# EasyEDA Pro project ProProject_FPGA_oscilloscope Analog pre circuit PCB_2024-04-16.epro, board PCB1
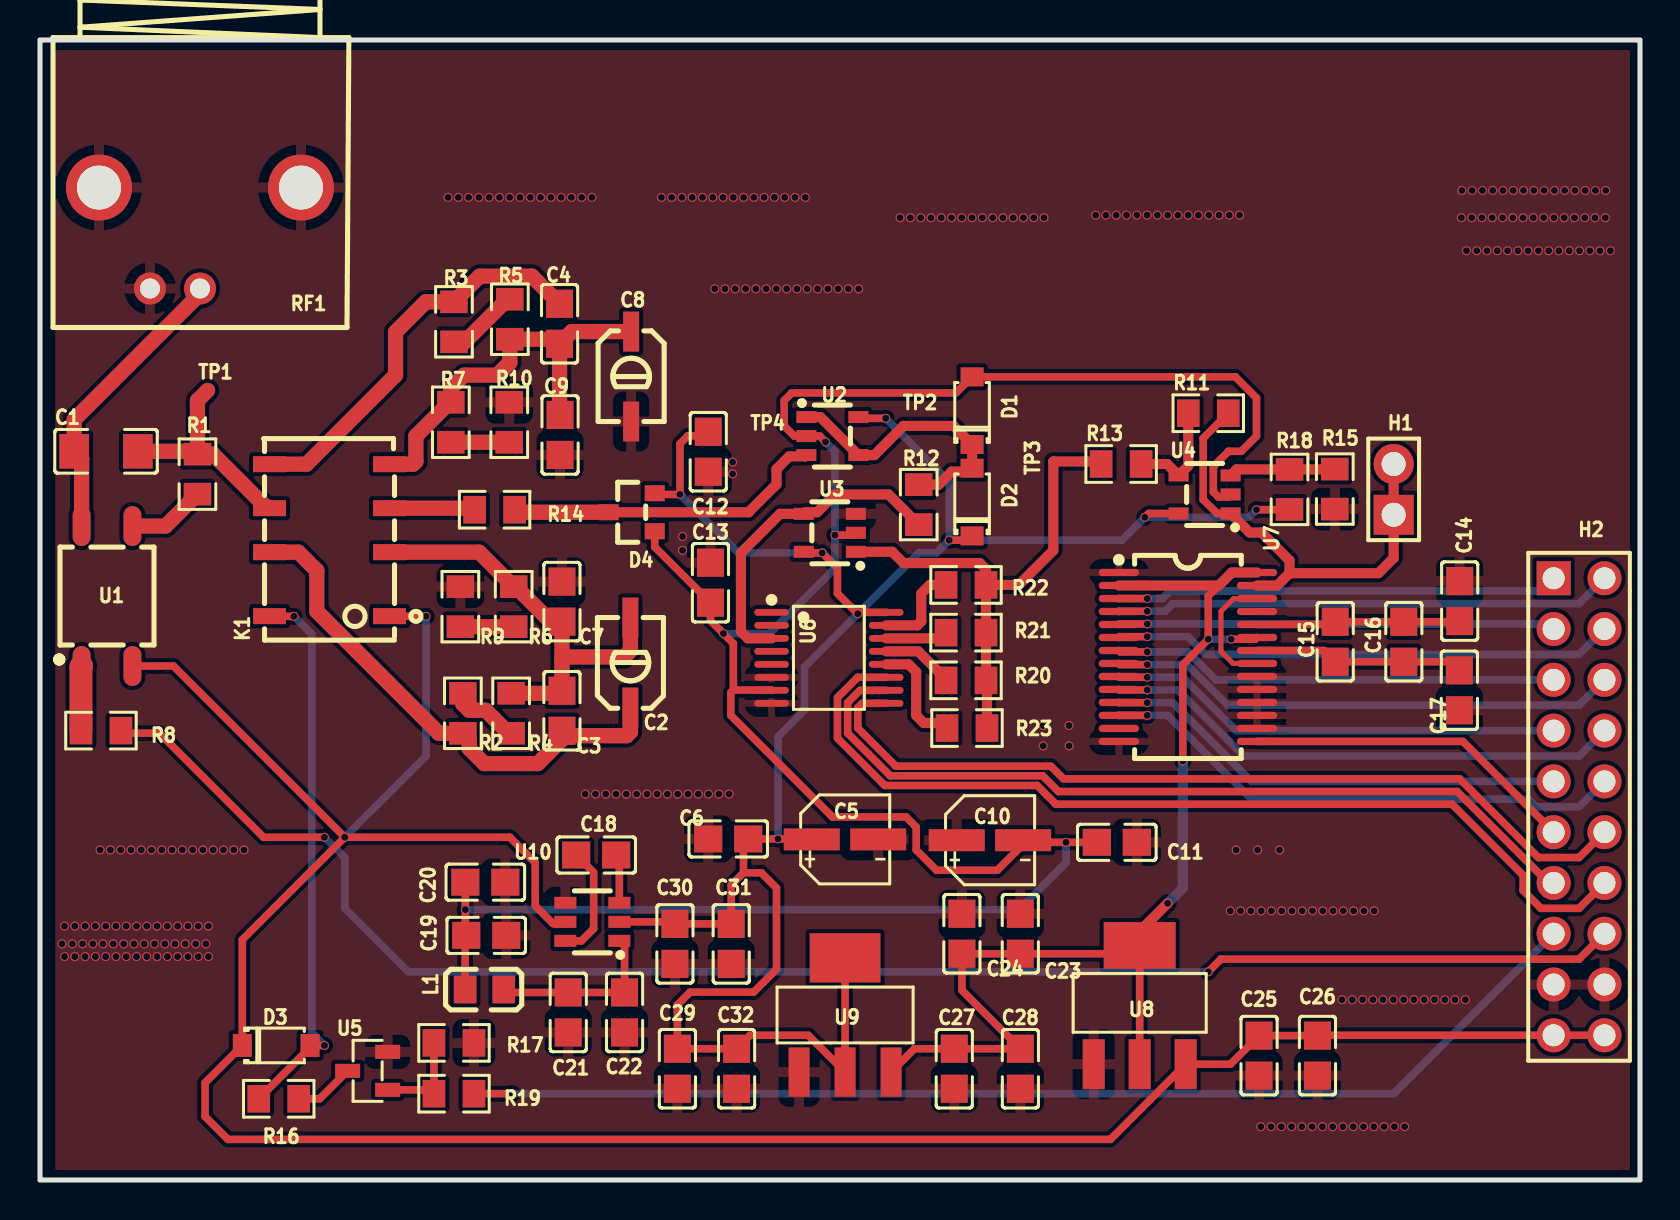
[diagram p2: board, top side]
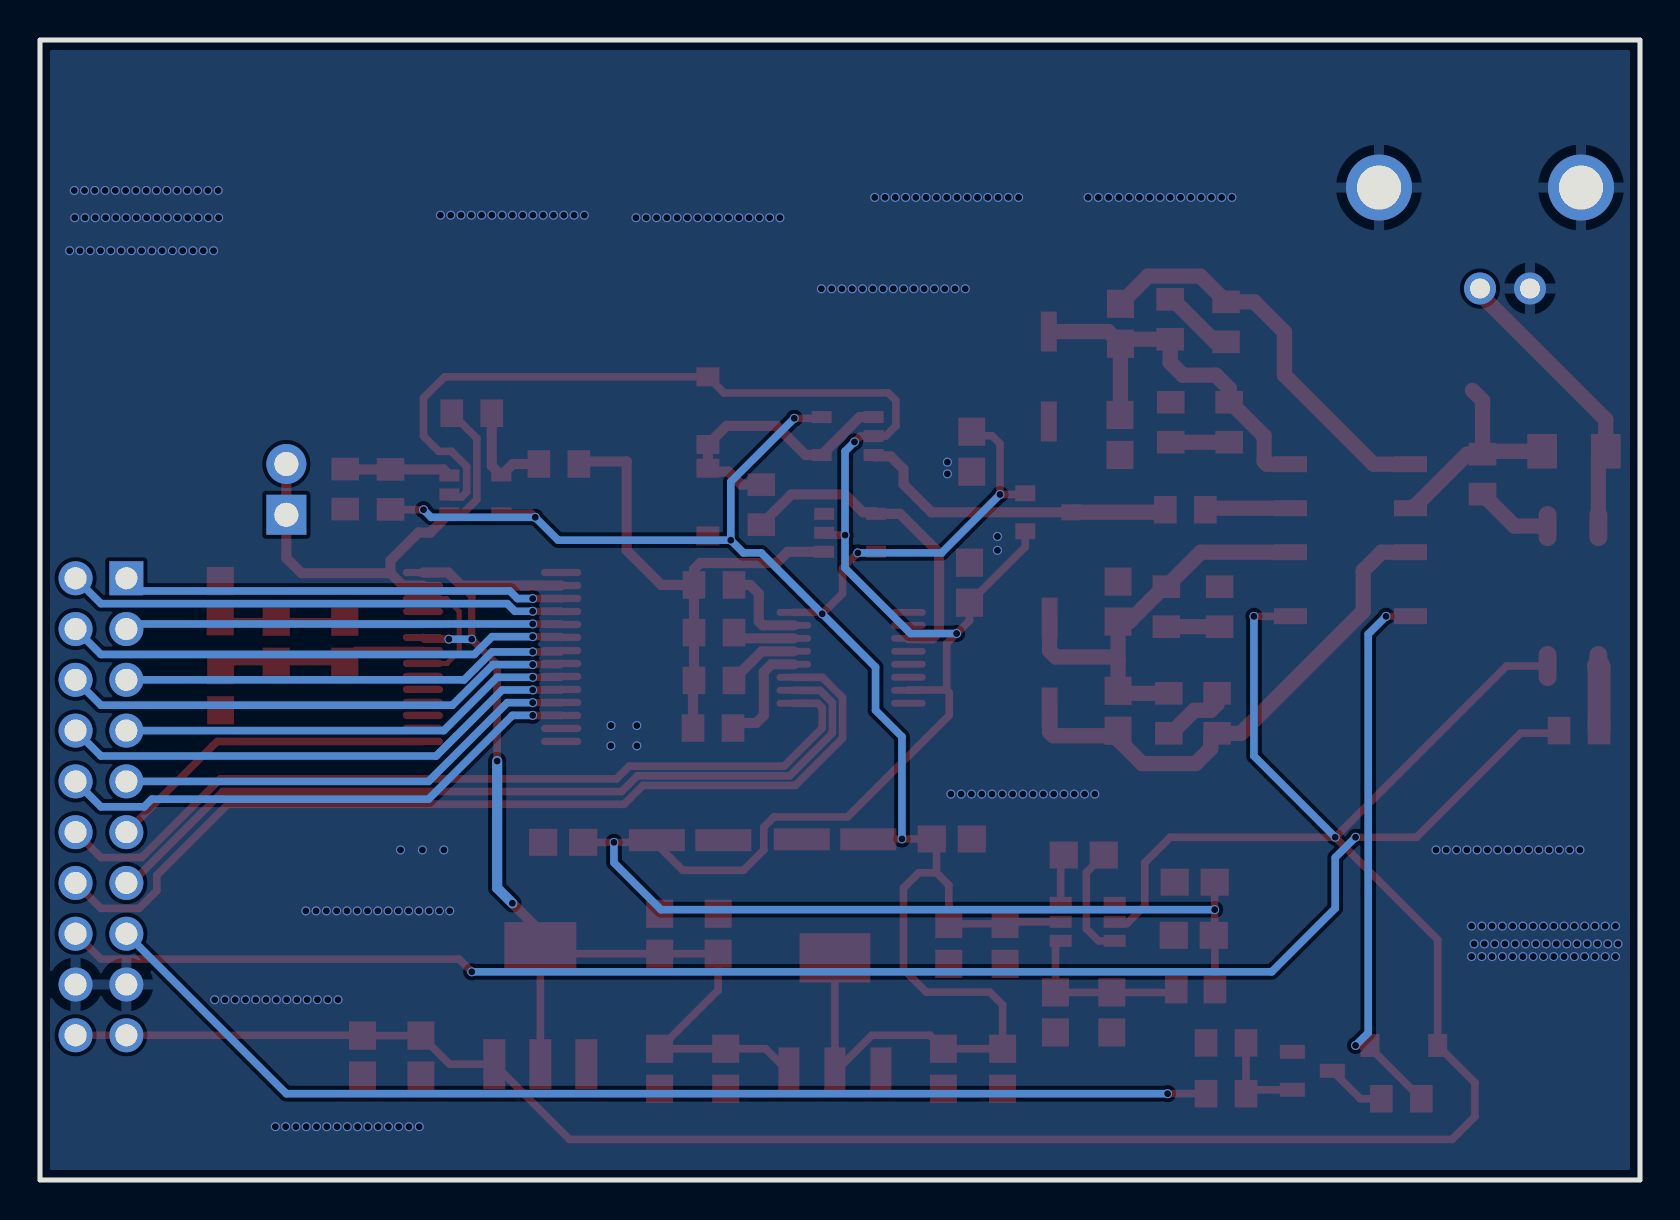
[diagram p3: board, bottom side, seen from below]

Outline 80.01 x 57.02 mm; copper layers: Top Layer, Bottom Layer. Coordinates in mm from the lower left corner of the outline.
Outline path: rectangle 0,57.02 80.01,0
Stack: Top Layer 0.035mm / Dielectric1 1.51mm FR4 er 4.5 / Bottom Layer 0.035mm

## Design rules (mm)
template: 自定义配置
spacing copperThickness1oz (default): track to track 0.102, other pairs 0.152 to 0.3
spacing copperThickness2oz: track to track 0.203, other pairs 0.152 to 0.3
track width copperThickness1oz (default): min 0.127, default 0.254, max 2.54
track width copperThickness2oz: min 0.203, default 0.254, max 2.54
differential pair differentialPair (default): width min 0.127, default 0.254, max 2.54; gap min 0.152, default 0.152
via viaSize (default): diameter min 0.356, default 0.61, max 10; hole min 0.229, default 0.305, max 6.299

## Placement (name value [footprint] x y rotation side)
C1  22nF  [C1206]  3.3 36.45 0 top
C2  360pf  [CAP-SMD_L4.50-W3.20]  29.52 25.88 90 top
C3  TZC3Z060A110R00  [C0805]  26.1 23.47 270 top
C4  15Pf  [C0805]  25.98 42.83 90 top
C5  104pf  [CAP-SMD_BD4.0-L4.3-W4.3-FD-A]  40.25 17.04 0 top
C6  104pf  [C0805]  34.41 17.06 0 top
C7  TZC3Z060A110R00  [C0805]  26.1 28.93 270 top
C8  15Pf  [CAP-SMD_L4.50-W3.20]  29.56 40.19 270 top
C9  360pf  [C0805]  26.01 37.27 90 top
C10  22uF  [CAP-SMD_BD4.0-L4.3-W4.3-FD-A]  47.5 17 0 top
C11  22uF  [C0805]  53.85 16.89 180 top
C12  360pf  [C0805]  33.42 36.43 90 top
C13  360pf  [C0805]  33.53 29.88 270 top
C14  100nf  [C0805]  70.99 28.96 270 top
C15  100nf  [C0805]  64.77 26.92 90 top
C16  10uf  [C0805]  68.2 26.92 90 top
C17  100nf  [C0805]  70.98 24.49 90 top
C18  47uf  [C0805]  27.81 16.26 0 top
C19  10uf  [C0805]  22.31 12.24 180 top
C20  47uf  [C0805]  22.27 14.9 180 top
C21  10uf  [C0805]  26.42 8.38 90 top
C22  4.7uf  [C0805]  29.23 8.38 90 top
C23  100nf  [C0805]  49.02 12.32 270 top
C24  22uf  [C0805]  46.1 12.32 270 top
C25  10uf  [C0805]  60.96 6.22 90 top
C26  100nf  [C0805]  63.88 6.22 90 top
C27  100nf  [C0805]  45.72 5.57 90 top
C28  10uf  [C0805]  49.03 5.57 90 top
C29  22uf  [C0805]  31.87 5.57 90 top
C30  10uf  [C0805]  31.75 11.81 90 top
C31  47uf  [C0805]  34.57 11.81 90 top
C32  100nf  [C0805]  34.83 5.57 90 top
D1  1N4148W  [SOD-123_L2.8-W1.8-LS3.7-RD]  46.61 38.48 90 top
D2  BAV199LT1G  [SOD-123_L2.8-W1.8-LS3.7-RD]  46.61 33.91 90 top
D3  1N4148W  [SOD-123_L2.8-W1.8-LS3.7-RD]  11.81 6.73 0 top
D4  BAV199LT1G  [SOT-23_L2.9-W1.3-P1.90-LS2.4-BR]  29.59 33.4 0 top
H1  PZ254V-11-02P  [HDR-TH_2P-P2.54-V-M]  67.69 34.54 90 top
H2  PZ254V-12-20P  [HDR-TH_20P-P2.54-V-M-R2-C10-S2.54]  76.96 18.67 270 top
K1  HFD4/3-S1R  [RELAY-SMD_HFD4-3-S1R]  14.48 32 90 top
L1  YI201209U121-5R0T  [L0805]  22.22 9.52 0 top
R1  56Ω  [R0805]  7.87 35.31 270 top
R2  680kΩ  [R0805]  21.15 23.34 90 top
R3  300kΩ  [R0805]  20.7 42.93 270 top
R4  300kΩ  [R0805]  23.56 23.34 90 top
R5  300kΩ  [R0805]  23.5 43.05 270 top
R6  1.5kΩ  [R0805]  23.69 28.68 270 top
R7  4kΩ  [R0805]  20.54 37.9 270 top
R8  200kΩ  [R0805]  3.05 22.48 180 top
R9  1.5kΩ  [R0805]  21.02 28.68 90 top
R10  1.5kΩ  [R0805]  23.47 37.9 90 top
R11  1kΩ  [R0805]  58.42 38.35 0 top
R12  16kΩ  [R0805]  43.94 33.78 270 top
R13  200kΩ  [R0805]  54.06 35.81 0 top
R14  200kΩ  [R0805]  22.73 33.53 0 top
R15  100R  [R0805]  64.75 34.56 270 top
R16  3kΩ  [R0805]  11.94 4.06 180 top
R17  200kΩ  [R0805]  20.7 6.86 180 top
R18  200kΩ  [R0805]  62.48 34.54 90 top
R19  200kΩ  [R0805]  20.7 4.32 180 top
R20  3kΩ  [R0805]  46.31 24.99 0 top
R21  100R  [R0805]  46.31 27.38 0 top
R22  10K  [R0805]  46.31 29.77 0 top
R23  100R  [R0805]  46.35 22.61 0 top
RF1  KH-BNC75-3511  [ANT-TH_KH-BNC75-3511]  8 47.12 180 top
TP1  -  [Test-Point-0.5mm]  8.38 39.5 0 top
TP2  -  [Test-Point-0.5mm]  44.2 37.72 0 top
TP3  -  [Test-Point-0.5mm]  50.67 35.94 0 top
TP4  -  [Test-Point-0.5mm]  35.43 33.4 0 top
U1  AQY282SX  [SOP-4_L4.3-W4.4-P2.54-LS7.0-BL]  3.35 29.21 0 top
U2  GS8094-SR  [SOT-23-5_L3.0-W1.7-P0.95-LS2.8-BR]  39.62 37.21 180 top
U3  SI2302ADS-T1-JSM  [SOT-23-5_L3.0-W1.7-P0.95-LS2.8-BR]  39.5 32.37 0 top
U4  MS9280  [SOT-23-5_L3.0-W1.7-P0.95-LS2.8-BR]  58.24 34.29 0 top
U5  74HC4052PW,118  [SOT-23-3_L2.9-W1.3-P1.90-LS2.4-BR]  16.38 5.46 0 top
U6  AMS1117-3.3  [TSSOP-16_L5.0-W4.4-P0.65-LS6.4-BL]  39.45 26.12 270 top
U7  AMS1117-2.5V  [SSOP-28_L10.2-W5.3-P0.65-LS7.8-BL]  57.4 26.16 270 top
U8  SGM3204YN6G/TR  [SOT-223-3_L6.5-W3.5-P3.05-LS7.0]  54.99 8.76 270 top
U9  AMS1117-2.5V  [SOT-223_L6.5-W3.5-P2.30-LS7.0-BR]  40.26 8.25 270 top
U10  SGM3204YN6G/TR  [SOT-23-6_L2.9-W1.6-P0.95-LS2.8-BR]  27.62 12.91 0 top

## Footprints (pads in the part's own frame, mm; a bottom-side part is the same pattern mirrored in y, then rotated)
ANT-TH_KH-BNC75-3511
  round 1.6 hole 1: 1(0,2.525) 2(2.5,2.525)
  round 3.3 hole 2.2: 3(5.05,-2.525) 4(-5.05,-2.525)
C0805
  rect 1.41x1.35 smd: 1(-1,0) 2(1,0)
C1206
  rect 1.485x1.728 smd: 1(-1.593,0) 2(1.593,0)
CAP-SMD_BD4.0-L4.3-W4.3-FD-A
  rect 2.8x1.1 smd: 1(-1.661,0) 2(1.661,0)
CAP-SMD_L4.50-W3.20
  rect 2x0.8 smd: 1(-2.25,0) 2(2.25,0)
HDR-TH_2P-P2.54-V-M
  rect 2x2 hole 1.2: 1(-1.27,0)
  round 2 hole 1.2: 2(1.27,0)
HDR-TH_20P-P2.54-V-M-R2-C10-S2.54
  rect 1.7x1.7 hole 1.1: 1(-11.43,-1.27)
  round 1.7 hole 1.1: 2(-11.43,1.27) 3(-8.89,-1.27) 4(-8.89,1.27) 5(-6.35,-1.27) 6(-6.35,1.27) 7(-3.81,-1.27) 8(-3.81,1.27) 9(-1.27,-1.27) 10(-1.27,1.27) 11(1.27,-1.27) 12(1.27,1.27) 13(3.81,-1.27) 14(3.81,1.27) 15(6.35,-1.27) 16(6.35,1.27) 17(8.89,-1.27) 18(8.89,1.27) 19(11.43,-1.27) 20(11.43,1.27)
L0805
  rect 1.133x1.377 smd: 1(-0.966,0) 2(0.966,0)
R0805
  rect 1.133x1.377 smd: 1(-1,0) 2(1,0)
RELAY-SMD_HFD4-3-S1R
  rect 0.8x1.65 smd: 1(-3.8,-3) 2(-0.6,-3) 3(1.6,-3) 4(3.8,-3) 5(3.8,3) 6(1.6,3) 7(-0.6,3) 8(-3.8,3)
SOD-123_L2.8-W1.8-LS3.7-RD
  rect 0.95x1.15 smd: 1(-1.692,0) 2(1.692,0)
SOP-4_L4.3-W4.4-P2.54-LS7.0-BL
  oval 0.9x2 smd: 1(-1.27,-3.5) 2(1.27,-3.5) 3(1.27,3.5) 4(-1.27,3.5)
SOT-23-3_L2.9-W1.3-P1.90-LS2.4-BR
  rect 1.25x0.7 smd: 1(1,-0.95) 2(1,0.95) 3(-1,0)
SOT-23-5_L3.0-W1.7-P0.95-LS2.8-BR
  rect 1x0.6 smd: 1(1.3,-0.95) 2(1.3,0) 3(1.3,0.95) 4(-1.3,0.95) 5(-1.3,-0.95)
SOT-23-6_L2.9-W1.6-P0.95-LS2.8-BR
  rect 1.1x0.6 smd: 1(1.35,-0.95) 2(1.35,0) 3(1.35,0.95) 4(-1.35,0.95) 5(-1.35,0) 6(-1.35,-0.95)
SOT-23_L2.9-W1.3-P1.90-LS2.4-BR
  rect 1x0.8 smd: 1(1.15,-0.95) 2(1.15,0.95) 3(-1.15,0)
SOT-223-3_L6.5-W3.5-P3.05-LS7.0
  rect 2.5x1.1 smd: 1(2.97,-2.3) 2(2.97,0) 3(2.97,2.3)
  rect 2.34x3.6 smd: 4(-2.97,0)
SOT-223_L6.5-W3.5-P2.30-LS7.0-BR
  rect 2.465x1.05 smd: 1(2.857,-2.3) 2(2.857,0) 3(2.857,2.3)
  rect 2.465x3.54 smd: 4(-2.857,0)
SSOP-28_L10.2-W5.3-P0.65-LS7.8-BL
  oval 0.364x2.015 smd: 1(-4.225,-3.455) 2(-3.575,-3.455) 3(-2.925,-3.455) 4(-2.275,-3.455) 5(-1.625,-3.455) 6(-0.975,-3.455) 7(-0.325,-3.455) 8(0.325,-3.455) 9(0.975,-3.455) 10(1.625,-3.455) 11(2.275,-3.455) 12(2.925,-3.455) 13(3.575,-3.455) 14(4.225,-3.455) 15(4.225,3.455) 16(3.575,3.455) 17(2.925,3.455) 18(2.275,3.455) 19(1.625,3.455) 20(0.975,3.455) 21(0.325,3.455) 22(-0.325,3.455) 23(-0.975,3.455) 24(-1.625,3.455) 25(-2.275,3.455) 26(-2.925,3.455) 27(-3.575,3.455) 28(-4.225,3.455)
Test-Point-0.5mm
  round 0.5 smd: 1(0,0)
TSSOP-16_L5.0-W4.4-P0.65-LS6.4-BL
  oval 0.343x1.732 smd: 1(-2.275,-2.866) 2(-1.625,-2.866) 3(-0.975,-2.866) 4(-0.325,-2.866) 5(0.325,-2.866) 6(0.975,-2.866) 7(1.625,-2.866) 8(2.275,-2.866) 9(2.275,2.866) 10(1.625,2.866) 11(0.975,2.866) 12(0.325,2.866) 13(-0.325,2.866) 14(-0.975,2.866) 15(-1.625,2.866) 16(-2.275,2.866)

## Nets
2.5V: C5.1 C6.2 C12.2 C29.2 C30.2 C31.2 C32.2 D2.1 D4.2 R18.1 U2.5 U3.5 U4.5 U6.16 U9.2 U9.4 U10.2
+5V: C25.2 C26.2 D3.1 H2.19 H2.20 K1.1 U1.2 U8.3 U10.5
-2.5V: C10.2 C11.2 C13.2 C19.2 C20.2 D1.2 D4.1 L1.1 U2.2 U3.2 U4.2 U6.7
GND: C5.2 C6.1 C7.1 C8.2 C9.1 C10.1 C11.1 C12.1 C13.1 C14.1 C17.1 C19.1 C20.1 C21.1 C22.1 C23.1 C24.1 C25.1 C26.1 C27.1 C28.1 C29.1 C30.1 C31.1 C32.1 H2.17 H2.18 R9.2 R10.2 R15.2 R17.1 RF1.2 RF1.3 RF1.4 U3.3 U5.2 U6.6 U6.8 U7.1 U7.14 U7.16 U7.17 U7.18 U7.19 U7.20 U7.25 U8.1 U9.1 U10.4
3.3: C23.2 C24.2 C27.2 C28.2 U7.2 U7.23 U7.28 U8.2 U8.4 U9.3
ADC0_CLK: H2.11 U7.15
AIN1: H1.1 H1.2 R11.2 U4.1 U7.27
ANGOUT: R13.1 R20.2 R21.2 R22.2 R23.2 TP3.1 U3.1
D0: H2.1 U7.3
D1: H2.2 U7.4
D2: H2.3 U7.5
D3: H2.4 U7.6
D4: H2.5 U7.7
D5: H2.6 U7.8
D6: H2.7 U7.9
D7: H2.8 U7.10
D8: H2.9 U7.11
D9: H2.10 U7.12
DIORA0: H2.16 R8.1
DIORA1: H2.15 R19.1
RE0: D3.2 K1.8 R16.2
S0: H2.14 U6.11
S1: H2.13 U6.10
S2: H2.12 U6.9
Y0: R20.1 U6.13
Y1: R21.1 U6.14
Y2: R22.1 U6.15
Y3: R23.1 U6.12
Z: R12.2 U3.4 U6.3
$1N691: C1.1 RF1.1 U1.4
$1N811: R8.2 U1.1
$1N857: R1.2 U1.3
$1N871: C1.2 K1.6 R1.1 TP1.1
$1N1249: C2.1 C3.2 K1.7 R2.1
$1N1320: K1.3 R14.1
$1N1547: C2.2 C3.1 C7.2 K1.2 R4.2 R6.1
$1N1899: R17.2 R19.2 U5.1
$1N2058: R16.1 U5.3
$1N2253: D4.3 R14.2 TP4.1 U2.3
$1N6224: R6.2 R9.1
$1N6262: R2.2 R4.1
$1N6325: C4.2 K1.5 R3.1
$1N6377: R3.2 R5.1
$1N6535: R7.2 R10.1
$1N6629: D1.1 D2.2 R12.1 TP2.1 U2.1 U2.4
$1N7875: R11.1 R13.2 U4.4
$1N8016: R15.1 R18.2 U4.3
$1N8606: U7.21 U7.26
$1N17008: C21.2 C22.2 L1.2 U10.1
$1N17602: C14.2 C15.2 C16.2 U7.24
$1N17632: C15.1 C16.1 C17.2 U7.22
$1N20744: C18.1 U10.6
$1N20751: C18.2 U10.3
$1N20802: C4.1 C8.1 C9.2 K1.4 R5.2 R7.1

Pads without a net: U6 1 2 4 5; U7 13

## Via types
v1: diameter 0.45, hole 0.35, Top Layer to Bottom Layer, 283 vias

## Routing (per net, layer and track width the routed paths; a pad name or vN(x,y) marks a point on that pad's centre or on a via; arc(x,y) is an arc through that point)
2.5V: length 111.1
  Top Layer w0.381: C12.2 33.21,37.22 32.4,37.22 32,36.83 v1(32,34.29) 30.8,34.29 D4.2 ; 35.18,15.37 35.18,16.82 C6.2 v1(36.91,17.06) 38.57,17.06 C5.1 ; 35.18,15.37 36.07,15.37 36.83,14.6 36.83,10.54 35.69,9.4 32.51,9.4 31.87,8.76 C29.2 C32.2 35.51,7.24 38.42,7.24 U9.2 U9.4 ; 35.18,15.37 34.57,14.75 34.57,13.08 ; 34.57,13.08 C31.2 ; 34.57,13.08 34.29,12.81 C30.2 31.65,12.91 U10.2 ; U4.5 55.44,33.34 v1(55.25,33.15) ; v1(45.47,32) 46.4,32 D2.1 ; U3.5 38.25,31.37 v1(39.12,31.37) 39.88,30.61 39.88,29.34 v1(40.89,28.32) 40.97,28.39 U6.16 ; 40.92,38.16 40.99,38.1 v1(42.29,38.1) ; R18.1 62.47,33.53 v1(60.83,33.53)
  Bottom Layer w0.381: v1(36.91,17.06) 36.91,22.17 38.23,23.49 38.23,25.65 v1(40.89,28.32) 43.94,31.37 44.83,31.37 v1(45.47,32) ; v1(60.83,33.53) 60.45,33.15 v1(55.25,33.15) 54.1,32 v1(45.47,32) ; v1(45.47,32) 45.47,34.92 v1(42.29,38.1) ; v1(32,34.29) 34.93,31.37 v1(39.12,31.37)
+5V: length 132.3
  Top Layer w0.381: U10.5 26.18,12.83 25.65,12.83 24.76,13.72 24.76,15.87 23.5,17.14 v1(15.24,17.14) ; v1(19.3,28.19) 17.49,28.19 K1.1 ; U1.2 6.67,25.71 v1(15.24,17.14) ; v1(15.24,17.14) 10.12,12.02 D3.1 8.25,4.87 8.25,3.17 9.4,2.03 53.53,2.03 U8.3 59.53,5.79 C25.2 C26.2 63.9,7.24 H2.19 H2.20
  Bottom Layer w0.381: v1(15.24,17.14) 19.3,21.21 v1(19.3,28.19)
-2.5V: length 122.9
  Top Layer w0.381: U3.2 40.68,32.26 v1(39.75,32.26) ; C20.2 v1(21.27,13.52) 21.27,12.19 ; 34.67,24.51 36.57,24.51 U6.7 ; 34.67,24.51 34.54,24.38 34.54,23.24 39.62,18.16 43.31,18.16 43.81,17.65 43.81,16.51 44.83,15.49 47.87,15.49 49.27,16.89 ; 34.67,24.51 34.67,26.84 v1(34.17,27.34) 33.53,27.98 C13.2 30.74,31.66 D4.1 ; 21.27,12.19 21.26,12.18 L1.1 ; 21.27,12.19 C19.2 ; 49.27,16.89 C10.2 ; 49.27,16.89 v1(51.31,16.89) C11.2 ; 59.54,34.29 59.41,34.16 58.93,34.16 58.67,34.42 58.67,35.69 59.44,36.45 60.07,36.45 60.83,37.21 60.83,39.12 59.78,40.17 D1.2 45.81,39.37 37.59,39.37 37.21,38.99 37.21,37.72 37.72,37.21 U2.2 38.99,37.21 v1(39.28,36.92)
  Bottom Layer w0.381: v1(34.17,27.34) 36.48,27.34 39.75,30.61 v1(39.75,32.26) 39.75,36.45 v1(39.28,36.92) ; v1(21.27,13.52) 48.96,13.52 51.31,15.87 v1(51.31,16.89)
GND:
  vias: v1(1.1,11.81) v1(1.23,12.7) v1(1.23,11.18) v1(1.61,11.81) v1(1.74,12.7) v1(1.74,11.18) v1(2.13,11.81) v1(2.26,12.7) v1(2.26,11.18) v1(2.64,11.81) v1(2.77,12.7) v1(2.77,11.18) v1(3.01,16.51) v1(3.16,11.81) v1(3.28,12.7) v1(3.28,11.18) v1(3.52,16.51) v1(3.67,11.81) v1(3.8,12.7) v1(3.8,11.18) v1(4.03,16.51) v1(4.19,11.81) v1(4.31,12.7) v1(4.31,11.18) v1(4.55,16.51) v1(4.7,11.81) v1(4.83,12.7) v1(4.83,11.18) v1(5.06,16.51) v1(5.21,11.81) v1(5.34,12.7) v1(5.34,11.18) v1(5.58,16.51) v1(5.73,11.81) v1(5.85,12.7) v1(5.85,11.18) v1(6.09,16.51) v1(6.24,11.81) v1(6.37,12.7) v1(6.37,11.18) v1(6.6,16.51) v1(6.75,11.81) v1(6.88,12.7) v1(6.88,11.18) v1(7.12,16.51) v1(7.27,11.81) v1(7.4,12.7) v1(7.4,11.18) v1(7.63,16.51) v1(7.78,11.81) v1(7.91,12.7) v1(7.91,11.18) v1(8.15,16.51) v1(8.3,11.81) v1(8.42,12.7) v1(8.42,11.18) v1(8.66,16.51) v1(9.17,16.51) v1(9.69,16.51) v1(10.2,16.51) v1(20.41,49.15) v1(20.92,49.15) v1(21.43,49.15) v1(21.95,49.15) v1(22.46,49.15) v1(22.97,49.15) v1(23.49,49.15) v1(24,49.15) v1(24.52,49.15) v1(25.03,49.15) v1(25.54,49.15) v1(26.06,49.15) v1(26.57,49.15) v1(27.09,49.15) v1(27.26,19.3) v1(27.6,49.15) v1(27.78,19.3) v1(28.29,19.3) v1(28.81,19.3) v1(29.32,19.3) v1(29.83,19.3) v1(30.35,19.3) v1(30.86,19.3) v1(31.07,49.15) v1(31.38,19.3) v1(31.59,49.15) v1(31.89,19.3) v1(32.1,49.15) v1(32.13,32.19) v1(32.13,31.5) v1(32.4,19.3) v1(32.62,49.15) v1(32.92,19.3) v1(33.13,49.15) v1(33.43,19.3) v1(33.64,49.15) v1(33.74,44.58) v1(33.94,19.3) v1(34.16,49.15) v1(34.25,44.58) v1(34.46,19.3) v1(34.67,49.15) v1(34.63,35.91) v1(34.63,35.32) v1(34.77,44.58) v1(35.19,49.15) v1(35.28,44.58) v1(35.7,49.15) v1(35.8,44.58) v1(36.21,49.15) v1(36.31,44.58) v1(36.73,49.15) v1(36.82,44.58) v1(37.24,49.15) v1(37.34,44.58) v1(37.75,49.15) v1(37.85,44.58) v1(38.27,49.15) v1(38.37,44.58) v1(38.88,44.58) v1(39.39,44.58) v1(39.91,44.58) v1(40.42,44.58) v1(40.94,44.58) v1(43.01,48.13) v1(43.53,48.13) v1(44.04,48.13) v1(44.55,48.13) v1(45.07,48.13) v1(45.58,48.13) v1(46.09,48.13) v1(46.61,48.13) v1(47.12,48.13) v1(47.64,48.13) v1(48.15,48.13) v1(48.66,48.13) v1(49.18,48.13) v1(49.69,48.13) v1(50.21,48.13) v1(50.16,22.73) v1(50.16,21.72) v1(51.46,22.73) v1(51.46,21.72) v1(52.79,48.26) v1(53.3,48.26) v1(53.82,48.26) v1(54.33,48.26) v1(54.85,48.26) v1(55.36,48.26) v1(55.87,48.26) v1(56.39,48.26) v1(56.9,48.26) v1(57.42,48.26) v1(57.93,48.26) v1(58.44,48.26) v1(58.96,48.26) v1(59.47,48.26) v1(59.52,13.46) v1(59.82,16.51) v1(59.99,48.26) v1(60.03,13.46) v1(60.55,13.46) v1(60.89,16.51) v1(61.06,13.46) v1(61.04,2.67) v1(61.58,13.46) v1(61.56,2.67) v1(61.98,16.51) v1(62.09,13.46) v1(62.07,2.67) v1(62.6,13.46) v1(62.59,2.67) v1(63.12,13.46) v1(63.1,2.67) v1(63.62,2.67) v1(63.63,13.46) v1(64.15,13.46) v1(64.13,2.67) v1(64.66,13.46) v1(64.64,2.67) v1(65.11,9.02) v1(65.18,13.46) v1(65.16,2.67) v1(65.62,9.02) v1(65.69,13.46) v1(65.67,2.67) v1(66.2,13.46) v1(66.14,9.02) v1(66.19,2.67) v1(66.72,13.46) v1(66.65,9.02) v1(66.7,2.67) v1(67.16,9.02) v1(67.21,2.67) v1(67.68,9.02) v1(67.73,2.67) v1(68.19,9.02) v1(68.24,2.67) v1(68.71,9.02) v1(69.22,9.02) v1(69.74,9.02) v1(70.25,9.02) v1(70.76,9.02) v1(71.1,49.49) v1(71.08,48.13) v1(71.28,9.02) v1(71.33,46.48) v1(71.62,49.49) v1(71.59,48.13) v1(71.85,46.48) v1(72.11,48.13) v1(72.13,49.49) v1(72.36,46.48) v1(72.62,48.13) v1(72.64,49.49) v1(72.87,46.48) v1(73.16,49.49) v1(73.13,48.13) v1(73.39,46.48) v1(73.67,49.49) v1(73.65,48.13) v1(73.9,46.48) v1(74.19,49.49) v1(74.16,48.13) v1(74.42,46.48) v1(74.7,49.49) v1(74.68,48.13) v1(74.93,46.48) v1(75.21,49.49) v1(75.19,48.13) v1(75.44,46.48) v1(75.7,48.13) v1(75.73,49.49) v1(75.96,46.48) v1(76.22,48.13) v1(76.24,49.49) v1(76.47,46.48) v1(76.76,49.49) v1(76.73,48.13) v1(76.99,46.48) v1(77.27,49.49) v1(77.25,48.13) v1(77.5,46.48) v1(77.78,49.49) v1(77.76,48.13) v1(78.01,46.48) v1(78.3,49.49) v1(78.27,48.13) v1(78.53,46.48)
3.3: length 57.2
  Top Layer w0.381: v1(57.15,20.95) 57.15,25.78 v1(58.42,27.05) 58.42,29.21 58.95,29.74 ; U8.2 U8.4 54.58,11.32 C23.2 C24.2 46.1,9.49 C28.2 C27.2 43.73,6.57 U9.3 ; v1(59.56,27.05) 60.77,27.05 U7.23
  Top Layer w0.508: U7.2 58.95,29.74 59.6,30.39 U7.28 ; U8.4 54.99,12.45 v1(56.39,13.84)
  Bottom Layer w0.381: v1(58.42,27.05) v1(59.56,27.05)
  Bottom Layer w0.508: v1(57.15,20.95) 57.15,14.6 v1(56.39,13.84)
ADC0_CLK: length 16.7
  Top Layer w0.381: U7.15 71.15,21.94 H2.11
AIN1: length 23.2
  Top Layer w0.381: R11.2 58.17,37.1 58.17,34.04 58.86,33.34 59.34,33.34
  Top Layer w0.508: U7.27 61.87,29.74 62.48,30.35 ; 62.48,30.35 62.48,30.99 61.09,32.38 60.49,32.38 59.54,33.34 59.34,33.34 ; 62.48,30.35 66.93,30.35 67.69,31.11 H1.1 H1.2
ANGOUT: length 25.8
  Top Layer w0.508: R22.2 47.31,30.54 46.99,30.86 43.18,30.86 42.62,31.42 U3.1 ; R22.2 48.94,29.77 50.67,31.5 TP3.1 52.94,35.94 R13.1 ; R22.2 R21.2 R20.2 47.35,24.94 R23.2
D0: length 22.2
  Top Layer w0.381: U7.3 53.95,29.08 v1(55.37,29.08)
  Bottom Layer w0.381: v1(55.37,29.08) 56.13,29.08 56.51,29.46 75.06,29.46 H2.1
D1: length 25
  Top Layer w0.381: U7.4 53.96,28.45 v1(55.37,28.45)
  Bottom Layer w0.381: H2.2 76.96,28.83 56.64,28.83 56.26,28.45 v1(55.37,28.45)
D2: length 21.9
  Top Layer w0.381: U7.5 53.97,27.81 v1(55.37,27.81)
  Bottom Layer w0.381: v1(55.37,27.81) 75.44,27.81 H2.3
D3: length 25.2
  Top Layer w0.381: U7.6 53.99,27.18 v1(55.37,27.18)
  Bottom Layer w0.381: v1(55.37,27.18) 57.4,27.18 58.29,26.29 76.96,26.29 H2.4
D4: length 22.4
  Top Layer w0.381: v1(55.37,26.42) 54.02,26.42 U7.7
  Bottom Layer w0.381: v1(55.37,26.42) 57.4,26.42 58.8,25.02 H2.5
D5: length 25.7
  Top Layer w0.381: U7.8 54,25.78 v1(55.37,25.78)
  Bottom Layer w0.381: H2.6 76.96,23.75 59.39,23.75 57.36,25.78 v1(55.37,25.78)
D6: length 22.9
  Top Layer w0.381: v1(55.37,25.15) 53.99,25.15 U7.9
  Bottom Layer w0.381: H2.7 59.82,22.48 57.15,25.15 v1(55.37,25.15)
D7: length 26.2
  Top Layer w0.381: U7.10 53.97,24.51 v1(55.37,24.51)
  Bottom Layer w0.381: v1(55.37,24.51) 56.9,24.51 60.2,21.21 76.96,21.21 H2.8
D8: length 23.4
  Top Layer w0.381: U7.11 53.96,23.88 v1(55.37,23.88)
  Bottom Layer w0.381: H2.9 60.58,19.94 56.64,23.88 v1(55.37,23.88)
D9: length 26.7
  Top Layer w0.381: v1(55.37,23.24) 53.95,23.24 U7.12
  Bottom Layer w0.381: H2.10 76.96,18.67 74.8,18.67 74.42,19.05 60.58,19.05 56.39,23.24 v1(55.37,23.24)
DIORA0: length 81.5
  Top Layer w0.381: H2.16 76.96,11.05 59.06,11.05 v1(58.42,10.41) ; R8.1 4.17,22.35 5.97,22.35 11.18,17.14 v1(14.22,17.14)
  Bottom Layer w0.381: v1(58.42,10.41) 18.42,10.41 15.24,13.59 15.24,16.13 v1(14.22,17.14)
DIORA1: length 57.3
  Top Layer w0.381: v1(23.62,4.32) R19.1
  Bottom Layer w0.381: v1(23.62,4.32) 67.69,4.32 H2.15
RE0: length 27.8
  Top Layer w0.381: K1.8 11.49,28.19 v1(12.7,28.19) ; v1(14.22,6.73) D3.2 13.5,6.63 R16.2
  Bottom Layer w0.381: v1(14.22,6.73) 13.59,7.37 13.59,27.3 v1(12.7,28.19)
S0: length 47.7
  Top Layer w0.381: H2.14 76.96,13.59 75.06,13.59 74.17,14.48 74.17,15.24 70.61,18.8 50.8,18.8 49.86,19.74 42.24,19.74 39.88,22.1 39.88,24.13 40.89,25.14 U6.11
S1: length 42.1
  Top Layer w0.381: U6.10 41,24.49 40.39,23.88 40.39,22.35 42.52,20.22 50.14,20.22 50.93,19.43 70.87,19.43 75.44,14.86 H2.13
S2: length 43.1
  Top Layer w0.381: H2.12 76.96,16.13 74.93,16.13 70.99,20.07 51.18,20.07 50.55,20.7 42.8,20.7 40.89,22.61 40.89,23.62 41.12,23.84 U6.9
Y0: length 3.6
  Top Layer w0.508: R20.1 45.31,25.05 43.91,26.44 U6.13
Y1: length 3.1
  Top Layer w0.508: R21.1 45.02,27.09 U6.14
Y2: length 4.6
  Top Layer w0.508: U6.15 43.87,27.74 44.07,27.94 44.07,29.34 44.5,29.77 R22.1
Y3: length 5.6
  Top Layer w0.508: U6.12 43.43,25.79 43.81,25.41 43.81,23.24 44.2,22.86 45.1,22.86 R23.1
Z: length 16.3
  Top Layer w0.508: R12.2 42.43,34.29 39.75,34.29 38.86,33.4 38.28,33.4 U3.4 37,33.32 35.05,31.37 35.05,27.43 35.39,27.09 U6.3
$1N691: length 14.6
  Top Layer w0.762: U1.4 2.08,36.08 C1.1 1.71,38.03 8,44.32 RF1.1
$1N811: length 3.2
  Top Layer w1.143: R8.2 2.05,25.68 U1.1
$1N857: length 3.9
  Top Layer w0.762: R1.2 6.28,32.71 U1.3
$1N871: length 11.2
  Top Layer w0.762: R1.1 7.73,36.45 C1.2 ; R1.1 8.65,36.31 11.3,33.65 11.43,33.65 K1.6 ; R1.1 7.87,38.99 TP1.1
$1N1249: length 26.2
  Top Layer w0.762: K1.7 12.92,31.4 13.84,30.48 13.84,28.45 19.95,22.34 R2.1 21.46,22.03 21.46,21.59 22.22,20.83 24.89,20.83 26.1,22.04 C3.2 26.35,22.22 29.34,22.22 29.52,22.41 C2.1
$1N1320: length 4.3
  Top Layer w0.762: K1.3 21.66,33.6 R14.1
$1N1547: length 21.4
  Top Layer w0.762: K1.2 21.96,31.4 R6.1 23.79,29.68 25.53,27.93 C7.2 26.1,26.03 ; 26.1,26.03 C3.1 25.97,24.34 R4.2 ; 26.1,26.03 26.23,26.16 29.21,26.16 29.52,26.48 C2.2
$1N1899: length 4.9
  Top Layer w0.381: U5.1 19.51,4.51 R19.2 R17.2
$1N2058: length 3
  Top Layer w0.381: U5.3 13.99,4.06 R16.1
$1N2253: length 16.3
  Top Layer w0.508: D4.3 TP4.1 36.83,34.8 36.83,35.56 37.47,36.19 38.26,36.19 U2.3
  Top Layer w0.762: R14.2 23.86,33.4 D4.3
$1N6224: length 2.7
  Top Layer w0.762: R6.2 R9.1
$1N6262: length 3.6
  Top Layer w0.762: R2.2 21.15,23.81 21.46,23.49 22.29,23.49 23.44,22.34 R4.1
$1N6325: length 20.2
  Top Layer w0.762: C4.2 24.6,45.21 21.99,45.21 R3.1 19.29,43.93 17.78,42.42 17.78,40.26 13.33,35.8 K1.5
$1N6377: length 3.7
  Top Layer w0.762: R5.1 23.37,44.05 21.25,41.93 R3.2
$1N6535: length 2.9
  Top Layer w0.762: R7.2 R10.1
$1N6629: length 14.3
  Top Layer w0.508: R12.1 44.94,34.78 45.59,35.43 46.44,35.43 D2.2 D1.1 45.68,37.72 TP2.1 43.18,37.72 41.72,36.26 U2.4 39.02,38.16 38.32,38.16
$1N7875: length 5.4
  Top Layer w0.508: R11.1 57.42,35.72 U4.4 56.36,35.81 R13.2
$1N8016: length 5.3
  Top Layer w0.508: 59.54,35.24 59.84,35.54 R18.2 64.73,35.54 R15.1
$1N8606: length 6.1
  Top Layer w0.254: U7.21 59.66,25.84 59.06,26.44 59.06,28.45 59.69,29.08 60.85,29.08 U7.26
$1N17008: length 8.8
  Top Layer w0.381: U10.1 29.23,11.7 C22.2 C21.2 23.33,9.38 L1.2
$1N17602: length 10.2
  Top Layer w0.381: U7.24 64.63,27.79 C15.2 C16.2 70.96,27.92 C14.2
$1N17632: length 10.5
  Top Layer w0.381: C17.2 70.55,25.92 C16.1 C15.1 64.21,26.49 U7.22
$1N20744: length 5.7
  Top Layer w0.381: U10.6 27.08,11.96 27.69,12.57 27.69,15.38 C18.1
$1N20751: length 2.5
  Top Layer w0.381: C18.2 28.97,16.1 U10.3
$1N20802: length 20.4
  Top Layer w0.762: K1.4 18.66,35.8 18.8,35.94 18.8,37.21 20.49,38.9 R7.1 20.54,39.59 21.21,40.26 22.86,40.26 23.5,40.89 R5.2 25.76,42.05 C4.1 ; C4.1 26.59,42.44 C8.1 ; C4.1 25.98,38.29 C9.2

## Copper pours and planes (outline as drawn; the poured copper is in the pictures)
GND on Top Layer: 0.76,57.4 80.77,57.4 80.77,0.13 0.76,0.13
GND on Bottom Layer: 0.13,57.53 79.88,57.53 79.88,0.38 0.13,0.38
